# EasyEDA schematic breathing LED.json
TITLE: Breathing LED Circuit; REV: 1.0; Date: 2023-11-13; Sheet: 1/1; Company: Divesh Software
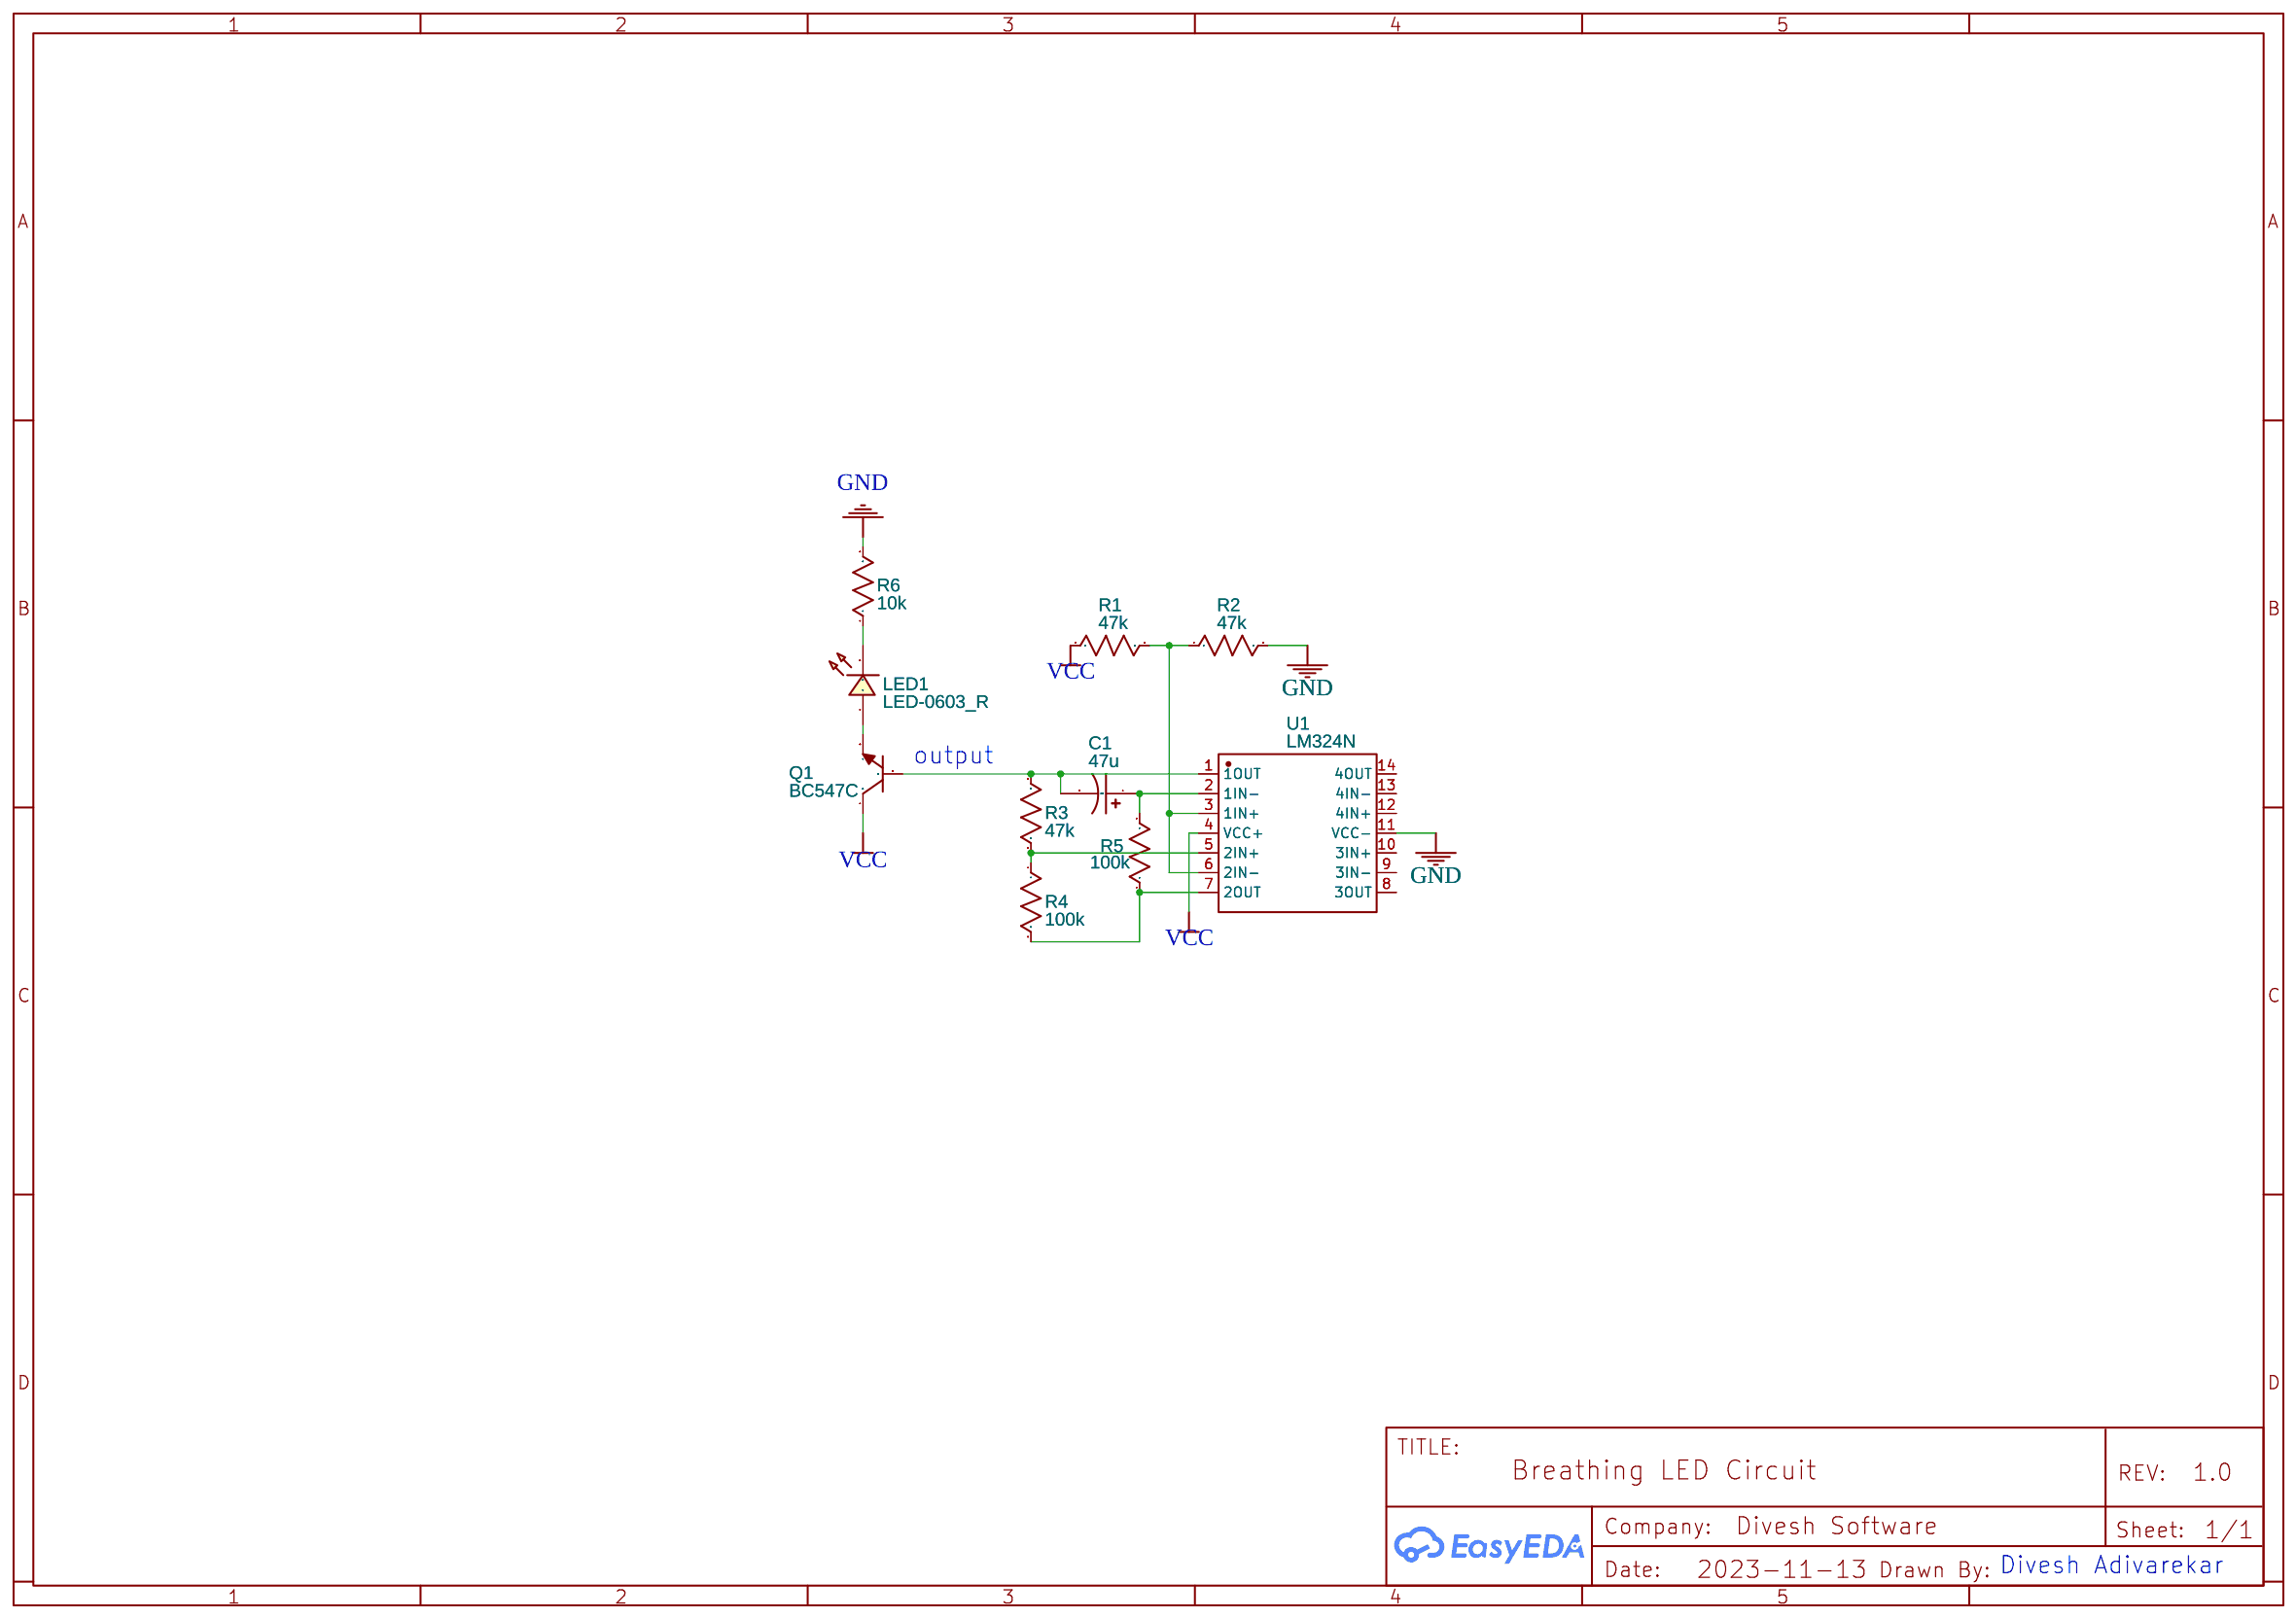
[diagram p0: schematic sheet]

## Parts
C1  47u  [CASE-A_3216]
LED1  LED-0603_R  [LED0603_RED]
Q1  BC547C  [TO-92-3_L4.9-W3.7-P1.27-L]
R1  47k  [R0603]
R2  47k  [R0603]
R3  47k  [R0603]
R4  100k  [R0603]
R5  100k  [R0603]
R6  10k  [R0603]
U1  LM324N  [DIP-14_L19.3-W7.0-P2.54-LS7.6-BL]

## Library data of the parts
C1 = C_Tan_SMD_A_US: Contributor: LCEDA_Lib
LED1 = LED-0603_R: Manufacturer: EVERLIGHT(台湾亿光); Manufacturer Part: 19-217/R6C-AL1M2VY/3T; Supplier Part: C72044; Supplier: LCSC; Contributor: LCEDA_01
Q1 = BC547C: Contributor: LCSC; Supplier: LCSC; Supplier Part: C713614; Manufacturer: LGE(鲁光); JLCPCB Part Class: Extended Part; link: https://lcsc.com/eda_search?q=C713614&%26type=1&ref=editor
R1-R6 = R_0603_US: Contributor: LCEDA_Lib
U1 = LM324N: Contributor: LCSC; Supplier: LCSC; Manufacturer: TI(德州仪器); Supplier Part: C114380; JLCPCB Part Class: Extended Part; link: https://lcsc.com/eda_search?q=C114380&%26type=1&ref=editor

## Nets
GND: R2.2 R6.2 U1.11(VCC-)
VCC: Q1.1(C) R1.1 U1.4(VCC+)
Net-(C1-1): C1.1 R5.2 U1.2(1IN-)
Net-(C1-2): C1.2 Q1.2(B) R3.2 U1.1(1OUT)
Net-(LED1-1): LED1.1 Q1.3(E)
Net-(LED1-2): LED1.2 R6.1
Net-(R1-2): R1.2 R2.1 U1.3(1IN+) U1.6(2IN-)
Net-(R3-1): R3.1 R4.1 U1.5(2IN+)
Net-(R4-2): R4.2 R5.1 U1.7(2OUT)

Not connected (* = marked no-connect by the designer): U1 8(3OUT) 9(3IN-) 10(3IN+) 12(4IN+) 13(4IN-) 14(4OUT)

## Notes on the sheet
- output
- Divesh Adivarekar
